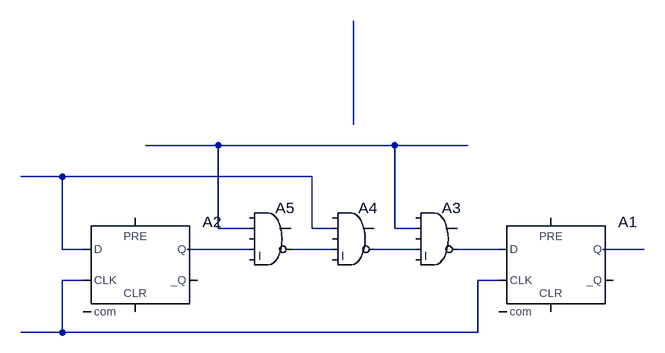
[diagram p0: schematic 1cycle.asc]
1cycle.asc, the LTspice schematic file:
Version 4
SHEET 1 880 680
WIRE -208 32 -320 32
WIRE 64 32 -208 32
WIRE 176 32 64 32
WIRE -448 80 -512 80
WIRE -64 80 -448 80
WIRE -208 160 -208 32
WIRE -160 160 -208 160
WIRE -64 160 -64 80
WIRE -32 160 -64 160
WIRE 64 160 64 32
WIRE 96 160 64 160
WIRE -448 192 -448 80
WIRE -416 192 -448 192
WIRE -160 192 -256 192
WIRE -32 192 -96 192
WIRE 96 192 32 192
WIRE 224 192 160 192
WIRE 448 192 384 192
WIRE -416 240 -448 240
WIRE 224 240 192 240
WIRE -448 320 -448 240
WIRE -448 320 -512 320
WIRE 192 320 192 240
WIRE 192 320 -448 320
WIRE 0 -160 0 0
SYMBOL Digital\\dflop 304 144 R0
SYMATTR InstName A1
SYMBOL Digital\\dflop -336 144 R0
SYMATTR InstName A2
SYMBOL Digital\\and 128 112 R0
SYMATTR InstName A3
SYMBOL Digital\\and 0 112 R0
SYMATTR InstName A4
SYMBOL Digital\\and -128 112 R0
SYMATTR InstName A5

The netlist it stands for:
* 1cycle.asc
A1 N006 0 N008 0 0 0 N007 0 DFLOP
A2 N002 0 N008 0 0 0 N003 0 DFLOP
A3 0 N001 0 N005 0 N006 0 0 AND
A4 0 N002 0 N004 0 N005 0 0 AND
A5 0 N001 0 N003 0 N004 0 0 AND
.backanno
.end